# EAGLE design semafor-a (EAGLE 9.2.2)
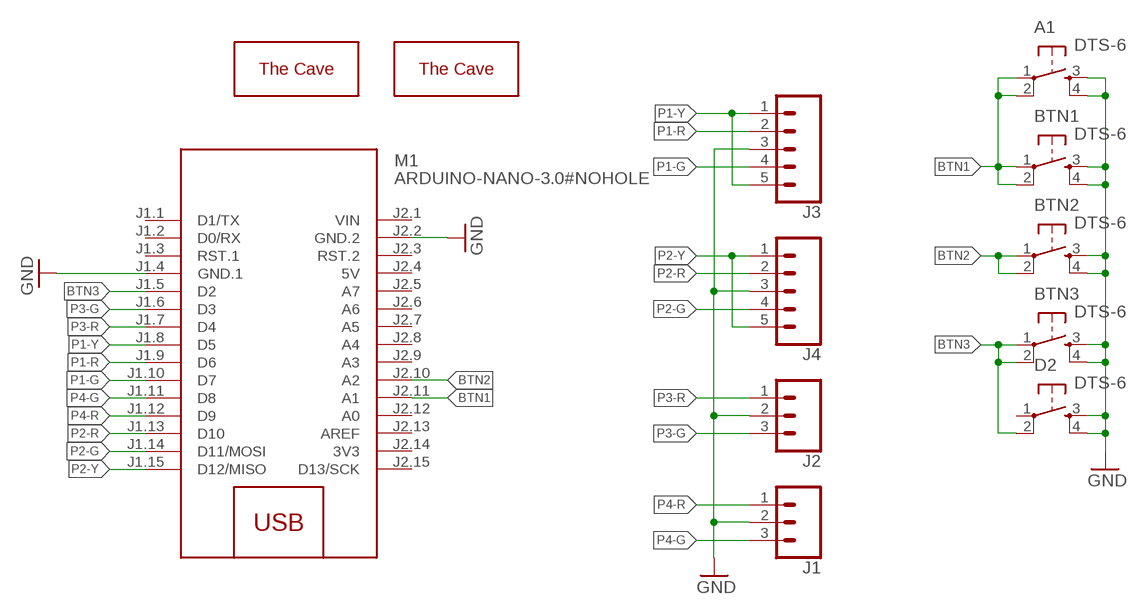
[diagram p0: schematic, sheet 1]

## Parts
A1  DTS-6  [DTS-6]
BTN1  DTS-6  [DTS-6]
BTN2  DTS-6  [DTS-6]
BTN3  DTS-6  [DTS-6]
D2  DTS-6  [DTS-6]
J1  CONN_031X03_NO_SILK  [1X03_NO_SILK]
J2  CONN_031X03_NO_SILK  [1X03_NO_SILK]
J3  CONN_05NO_SILK  [1X05_NO_SILK]
J4  CONN_05NO_SILK  [1X05_NO_SILK]
M1  ARDUINO-NANO-3.0#NOHOLE  [ARDUINO-NANO-3.0]
U$1  THECAVE_LOGO_NEW_TOP_SMALL  [NEW_LOGO_SMALL_TOP]
U$2  THECAVE_LOGO_NEW_BOTTOM  [NEW_LOGO_BOTTOM]

## Nets
BTN1: A1.1 A1.2 BTN1.1 BTN1.2 M1.J2.11(A1)
BTN2: BTN2.1 BTN2.2 M1.J2.10(A2)
BTN3: BTN3.1 BTN3.2 D2.2 M1.J1.5(D2)
GND: A1.3 A1.4 BTN1.3 BTN1.4 BTN2.3 BTN2.4 BTN3.3 BTN3.4 D2.3 D2.4 J1.2 J2.2 J3.3 J4.3 M1.J1.4(GND.1) M1.J2.2(GND.2)
P1-G: J3.4 M1.J1.10(D7)
P1-R: J3.2 M1.J1.9(D6)
P1-Y: J3.1 J3.5 M1.J1.8(D5)
P2-G: J4.4 M1.J1.14(D11/MOSI)
P2-R: J4.2 M1.J1.13(D10)
P2-Y: J4.1 J4.5 M1.J1.15(D12/MISO)
P3-G: J2.3 M1.J1.6(D3)
P3-R: J2.1 M1.J1.7(D4)
P4-G: J1.3 M1.J1.11(D8)
P4-R: J1.1 M1.J1.12(D9)
Unconnected: D2.1 M1.J1.1(D1/TX) M1.J1.2(D0/RX) M1.J1.3(RST.1) M1.J2.3(RST.2) M1.J2.5(A7) M1.J2.6(A6) M1.J2.7(A5) M1.J2.8(A4) M1.J2.9(A3) M1.J2.12(A0) M1.J2.13(AREF) M1.J2.15(D13/SCK)

## Power pins joined to a net without a drawn wire
3V3: M1.J2.14(3V3)
5V: M1.J2.4(5V)
VIN: M1.J2.1(VIN)

## Library data of the parts
A1 BTN1-BTN3 D2 = switch-tact:DTS-6
J1 J2 = SparkFun-Connectors:CONN_03: Multi connection point. Often used as Generic Header-pin footprint for 0.1 inch spaced/style header connections On any of the 0.1 inch spaced packages, you can populate with these: Break Away Headers - Straight <https://www.sparkfun.com/products/116> (PRT-00116) Break Away Male Headers - Right Angle <https://www.sparkfun.com/products/553> (PRT-00553) Female Headers <https://www.sparkfun.com/products/115> (PRT-00115) Break Away Headers - Machine Pin <https://www.sparkfun.com/products/117> (PRT-00117) Break Away Female Headers - Swiss Machine Pin <https://www.sparkfun.com/products/743> (PRT-00743) Stackable Header - 3 Pin (Female, 0.1") <https://www.sparkfun.com/products/13875> (PRT-13875) For SCREWTERMINALS and SPRING TERMINALS visit here: Screw Terimnals on SparkFun.com <https://www.sparkfun.com/search/results?term=Screw+Terminals> (5mm/3.5mm/2.54mm spacing) This device is also useful as a general connection point to wire up your design to another part of your project. Our various solder wires solder well into these plated through hole pads. Hook-Up Wire - Assortment (Stranded, 22 AWG) <https://www.sparkfun.com/products/11375> (PRT-11375) Hook-Up Wire - Assortment (Solid Core, 22 AWG) <https://www.sparkfun.com/products/11367> (PRT-11367) View the entire wire category on our website here <https://www.sparkfun.com/categories/141> Special notes: Molex polarized connector foot print use with SKU : PRT-08232 with associated crimp pins and housings.
J3 J4 = SparkFun-Connectors:CONN_05: Multi connection point. Often used as Generic Header-pin footprint for 0.1 inch spaced/style header connections On any of the 0.1 inch spaced packages, you can populate with these: Break Away Headers - Straight <https://www.sparkfun.com/products/116> (PRT-00116) Break Away Male Headers - Right Angle <https://www.sparkfun.com/products/553> (PRT-00553) Female Headers <https://www.sparkfun.com/products/115> (PRT-00115) Break Away Headers - Machine Pin <https://www.sparkfun.com/products/117> (PRT-00117) Break Away Female Headers - Swiss Machine Pin <https://www.sparkfun.com/products/743> (PRT-00743) For SCREWTERMINALS and SPRING TERMINALS visit here: Screw Terimnals on SparkFun.com <https://www.sparkfun.com/search/results?term=Screw+Terminals> (5mm/3.5mm/2.54mm spacing) This device is also useful as a general connection point to wire up your design to another part of your project. Our various solder wires solder well into these plated through hole pads. Hook-Up Wire - Assortment (Stranded, 22 AWG) <https://www.sparkfun.com/products/11375> (PRT-11375) Hook-Up Wire - Assortment (Solid Core, 22 AWG) <https://www.sparkfun.com/products/11367> (PRT-11367) View the entire wire category on our website here <https://www.sparkfun.com/categories/141> Special notes: Molex polarized connector foot print use with SKU : PRT-08231 with associated crimp pins and housings. 1MM SMD Version SKU: PRT-10208
M1 = thecave:ARDUINO-NANO-3.0: Arduino Nano 3.0 and compatible devices More details available here: https://www.arduino.cc/en/Main/ArduinoBoardNano Click here to find device on ebay.com <http://www.ebay.com/sch/arduino+nano>
U$1 U$2 = thecave:THECAVE_LOGO: The Cave DIY workshop logos thecave.cz

## Board
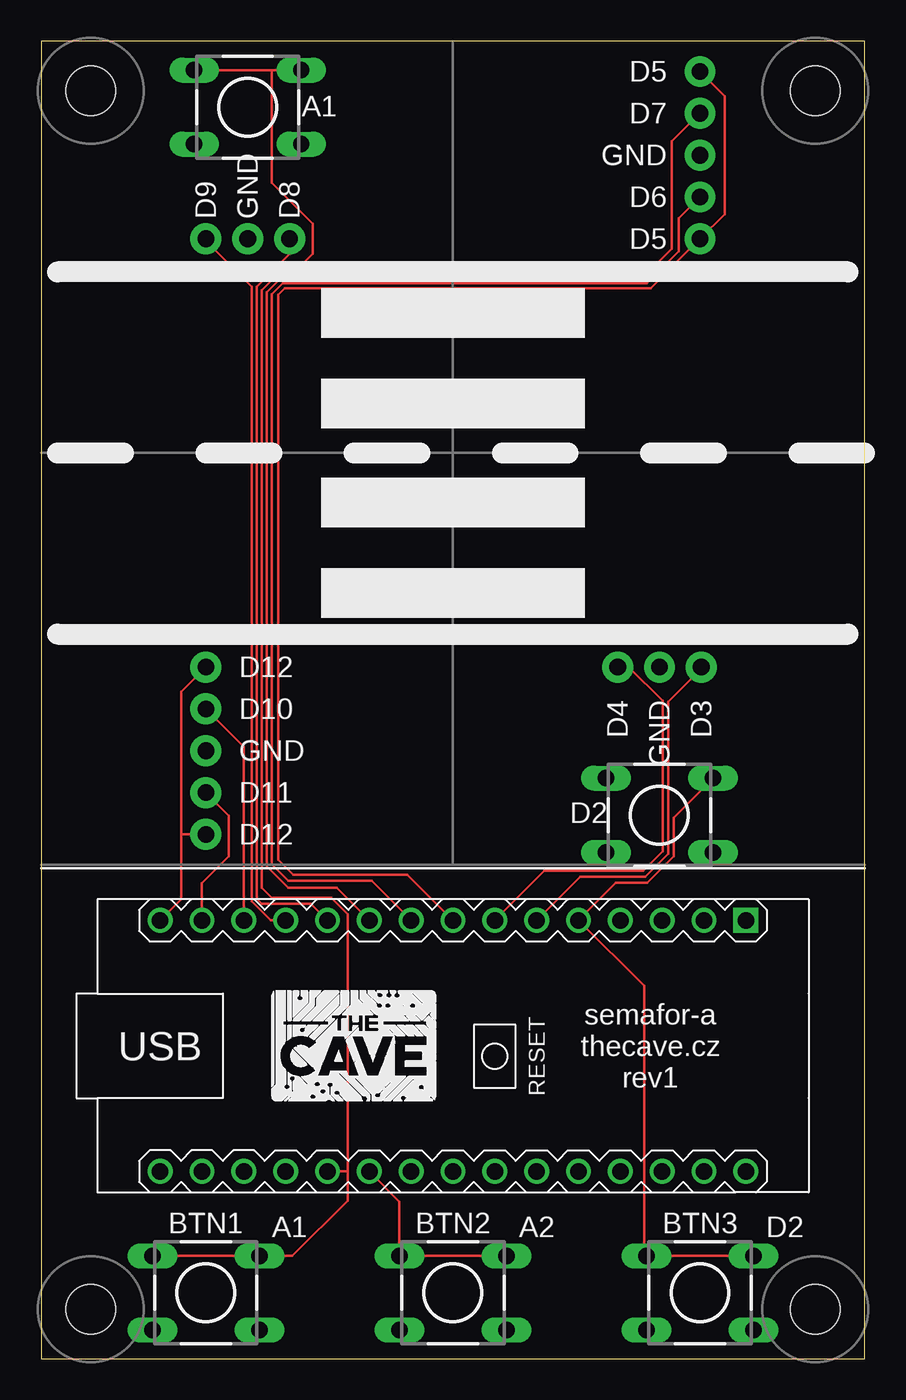
[diagram p1: board, top side]
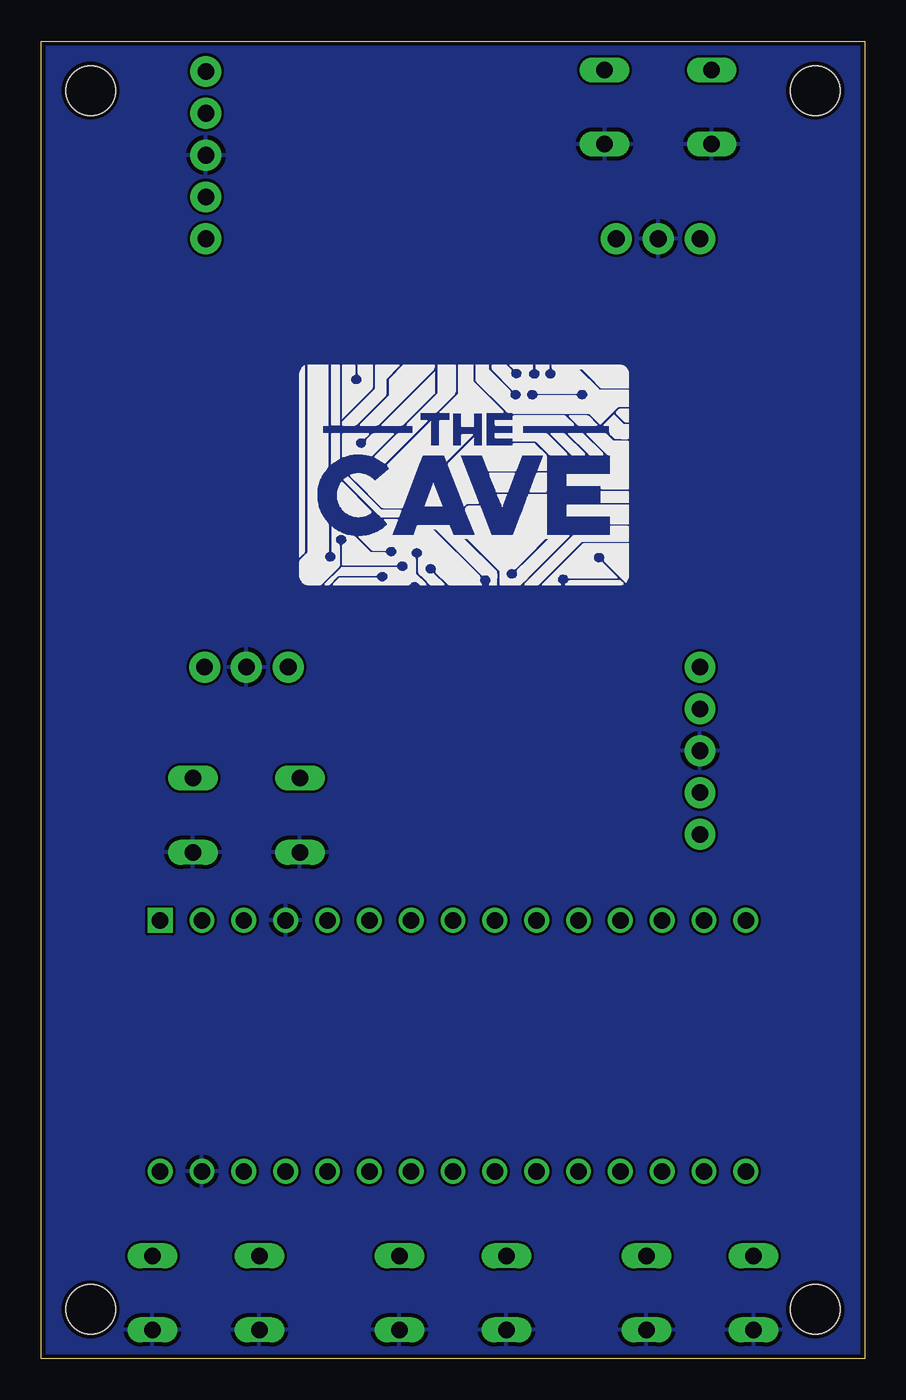
[diagram p2: board, bottom side, seen from below]

Size 50 x 80 mm. Coordinates in mm from the lower left corner, seen from the top.
Outline: 0,0 50,0 50,80 0,80 0,0
Copper layers (1*16): Top 0.035mm / dielectric 1.5mm / Bottom 0.035mm
Design rules "SeeedStudio_2layer_DRU_no_angle_20140221": minimum track width 6mil, minimum drill 12mil, track to track 6mil, track to pad 6mil, pad to pad 6mil, via to via 6mil, smd to smd 0mil, copper to edge 10mil, drill to drill 10mil, minimum pad ring 10mil, minimum via ring 6mil, stop-mask expansion 2mil, vias tented up to drill 100mil, thermal gap 10mil
Holes 3 mm at 3,3 47,3 47,77 3,77

### Footprints (pad centres in the part's own frame; a part is rotated, then mirrored left to right if it is on the bottom)
DTS-6 = drill 1 long: 1 -3.25,2.25; 2 3.25,2.25; 3 -3.25,-2.25; 4 3.25,-2.25
1X03_NO_SILK = drill 1.016 pad 1.88: 1 0,0; 2 2.54,0; 3 5.08,0
1X05_NO_SILK = drill 1.016 pad 1.88: 1 0,0; 2 2.54,0; 3 5.08,0; 4 7.62,0; 5 10.16,0
ARDUINO-NANO-3.0 = drill 1 square: J1.1 17.78,7.62 | drill 1: J1.2 15.24,7.62; J1.3 12.7,7.62; J1.4 10.16,7.62; J1.5 7.62,7.62; J1.6 5.08,7.62; J1.7 2.54,7.62; J1.8 0,7.62; J1.9 -2.54,7.62; J1.10 -5.08,7.62; J1.11 -7.62,7.62; J1.12 -10.16,7.62; J1.13 -12.7,7.62; J1.14 -15.24,7.62; J1.15 -17.78,7.62; J2.1 17.78,-7.62; J2.2 15.24,-7.62; J2.3 12.7,-7.62; J2.4 10.16,-7.62; J2.5 7.62,-7.62; J2.6 5.08,-7.62; J2.7 2.54,-7.62; J2.8 0,-7.62; J2.9 -2.54,-7.62; J2.10 -5.08,-7.62; J2.11 -7.62,-7.62; J2.12 -10.16,-7.62; J2.13 -12.7,-7.62; J2.14 -15.24,-7.62; J2.15 -17.78,-7.62

### Placement (x,y rotation side)
A1  12.54,76 0 top
BTN1  10,4 0 top
BTN2  25,4 0 top
BTN3  40,4 0 top
D2  37.54,33 0 top
J1  10,68 0 top
J2  35,42 0 top
J3  40,68 90 top
J4  10,42 270 top
M1  25,19 0 top
U$1  13.98,15.67 0 top
U$2  14,47 0 top

### Tracks (layer width: path | path; a pad name or v marks a point on that pad's centre or on a via)
BTN1
  Top 0.152: BTN1.1 BTN1.2 15.25,6.25 18.6,9.6 18.6,11.38 | A1.1 14,78.25 | 14,78.25 A1.2 | 18.6,11.38 18.6,27 17.6,28 14,28 13.38,28.61 13.38,64.89 14.8,66.3 15.7,66.3 16.5,67.1 16.5,68.9 14,71.4 14,78.25 | M1.J2.11 18.6,11.38
BTN2
  Top 0.152: BTN2.2 BTN2.1 21.75,9.55 M1.J2.10
BTN3
  Top 0.152: BTN3.2 BTN3.1 36.6,6.4 36.6,22.64 M1.J1.5 34.9,28.9 36.8,28.9 38.4,30.5 38.4,32.86 D2.2
GND
  pour Bottom: 0,80 50,80 50,0 0,0
P1-G
  Top 0.152: J3.4 38.3,73.92 38.3,67.4 36.51,65.61 14.55,65.61 13.7,64.76 13.7,29.91 15,28.6 17.94,28.6 M1.J1.10
P1-R
  Top 0.152: J3.2 38.7,69.24 38.7,67.24 36.77,65.31 14.67,65.31 14,64.63 14,30.03 15.02,29.02 20.06,29.02 M1.J1.9
P1-Y
  Top 0.152: J3.5 41.5,76.66 41.5,69.5 J3.1 37,65 14.8,65 14.4,64.6 14.4,30.3 15.3,29.4 22.22,29.4 M1.J1.8
P2-G
  Top 0.152: J4.4 11.4,32.98 11.4,30.5 9.76,28.86 M1.J1.14
P2-R
  Top 0.152: J4.2 12.3,37.16 M1.J1.13
P2-Y
  Top 0.152: M1.J1.15 8.5,27.9 8.5,31.8 | 8.5,31.8 8.5,40.5 J4.1 | J4.5 8.54,31.84 8.5,31.8
P3-G
  Top 0.152: J2.3 40.08,41.9 38.08,39.9 38.08,30.68 36.68,29.28 32.74,29.28 M1.J1.6
P3-R
  Top 0.152: J2.1 35.68,42 37.74,39.94 37.74,30.82 36.54,29.62 30.54,29.62 M1.J1.7
P4-G
  Top 0.152: M1.J1.11 16.38,27.62 13.38,27.62 13.08,27.92 13.08,65.1 15.08,67.1 J1.3
P4-R
  Top 0.152: J1.1 10,67.88 12.78,65.1 12.78,27.79 13.95,26.62 M1.J1.12

### Text on the board
tPlace: D5 | D7 | GND | D6 | D9 | GND | D8 | D5 | D12 | D4 | GND | D3 | D10 | GND | D11 | D12 | semafor-a / thecave.cz / rev1 | A1 | A2 | D2